# Altium schematic sheet oled_iic.SchDoc
size A4; SheetNumber: 5; SheetTotal: 6
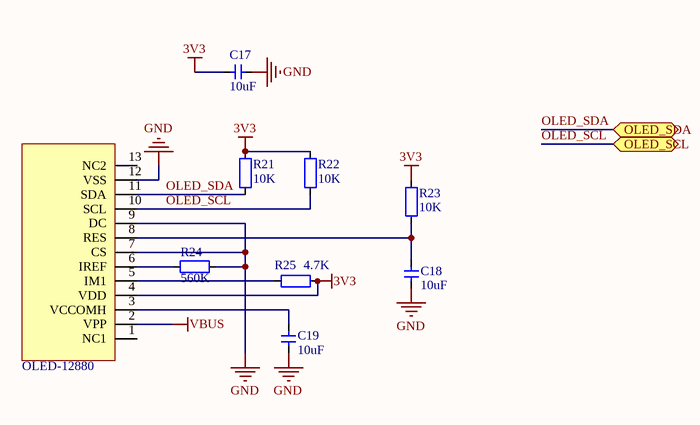
[diagram p0: oled_iic.SchDoc]

## Parts
1  OLED-12880  [OLED-12880]
C17  10uF  [CAP_0402]
C18  10uF  [CAP_0402]
C19  10uF  [CAP_0402]
R21  10K  [RES_0402]
R22  10K  [RES_0402]
R23  10K  [RES_0402]
R24  560K  [RES_0402]
R25  4.7K  [RES_0402]

## Ports
OLED_SCL (bidir), OLED_SDA (bidir)

## Nets
3V3: 1.4(VDD) C17.2 R21.2 R22.2 R23.2 R25.2
GND: 1.7(CS) 1.9(DC) 1.12(VSS) C17.1 C18.1 C19.1 R24.2
VBUS: 1.2(VPP)
OLED_SCL: 1.10(SCL) R22.1 ; port OLED_SCL
OLED_SDA: 1.11(SDA) R21.1 ; port OLED_SDA
Net1_3: 1.3(VCCOMH) C19.2
Net1_5: 1.5(IM1) R25.1
Net1_6: 1.6(IREF) R24.1
Net1_8: 1.8(RES) C18.2 R23.1

Not connected (* = marked no-connect by the designer): 1 1(NC1) 13(NC2)

## Library data of the parts
C17-C19 = 电容-0402: Capacitor; Value: 0.1u
R21-R25 = 电阻-0402: Resistor; Value: 22R